# Altium schematic sheet can-transceiver.SchDoc
size A3; DocumentNumber: 4; SheetNumber: 4; SheetTotal: 45; SheetDescription: CAN Transceiver
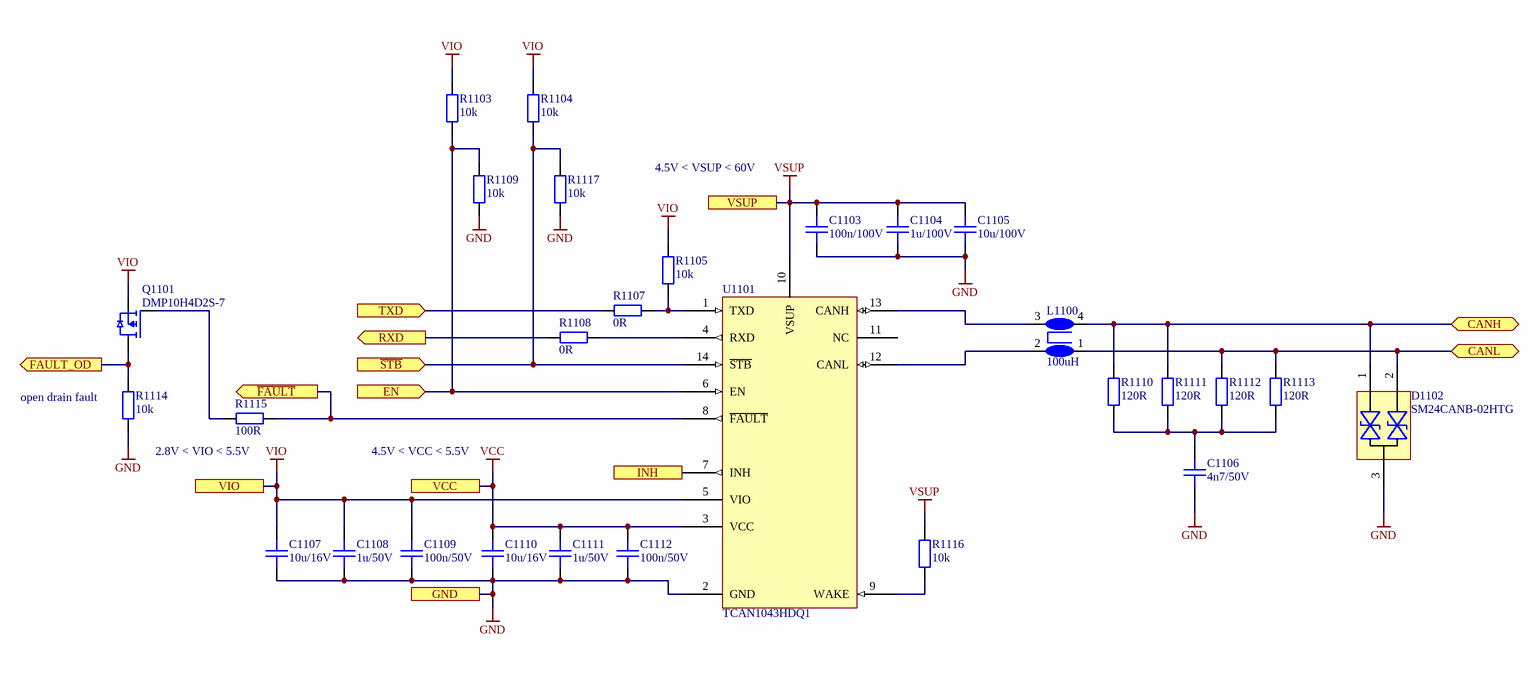
[diagram p0: can-transceiver.SchDoc]

## Parts
C1103  100n/100V  [CAPC1608X08N]
C1104  1u/100V  [CAPC3216X18N]
C1105  10u/100V  [CAPC5750X28N]
C1106  4n7/50V  [CAPC1005X06N]
C1107  10u/16V  [CAPC2012X14N]
C1108  1u/50V  [CAPC1608X08N]
C1109  100n/50V  [CAPC1005X06N]
C1110  10u/16V  [CAPC2012X14N]
C1111  1u/50V  [CAPC1608X08N]
C1112  100n/50V  [CAPC1005X06N]
D1102  SM24CANB-02HTG  [LF_SOT23-3]
L1100  100uH  [MURATA_DLW32SH]
Q1101  DMP10H4D2S-7  [SOT95P237X110-3N]
R1103  10k  [RESC1005X04N]
R1104  10k  [RESC1005X04N]
R1105  10k  [RESC1005X04N]
R1107  0R  [RESC1005X04N]
R1108  0R  [RESC1005X04N]
R1109  10k  [RESC1005X04N]
R1110  120R  [RESC3216X06N]
R1111  120R  [RESC3216X06N]
R1112  120R  [RESC3216X06N]
R1113  120R  [RESC3216X06N]
R1114  10k  [RESC1005X04N]
R1115  100R  [RESC1005X04N]
R1116  10k  [RESC1005X04N]
R1117  10k  [RESC1005X04N]
U1101  TCAN1043HDQ1  [TI_D0014A-C01_SOIC-14]

## Ports
CANH (bidir), CANL (bidir), EN (in), FAULT_OD (out), GND, INH, RXD (out), TXD (in), VCC, VIO, VSUP, ~{FAULT} (out), ~{STB} (in)

## Nets
GND: C1103.1 C1104.1 C1105.1 C1106.1 C1107.1 C1108.1 C1109.1 C1110.1 C1111.1 C1112.1 D1102.3 R1109.1 R1114.1 R1117.1 U1101.2(GND) ; port GND
VCC: C1110.2 C1111.2 C1112.2 U1101.3(VCC) ; port VCC
VIO: C1107.2 C1108.2 C1109.2 Q1101.S R1103.2 R1104.2 R1105.2 U1101.5(VIO) ; port VIO
VSUP: C1103.2 C1104.2 C1105.2 R1116.2 U1101.10(VSUP) ; port VSUP
~{FAULT}: R1115.2 U1101.8(~{FAULT}) ; port ~{FAULT}
~{STB}: R1104.1 R1117.2 U1101.14(~{STB}) ; port ~{STB}
CANH: D1102.1 L1100.4 R1110.2 R1111.2 ; port CANH
CANL: D1102.2 L1100.1 R1112.2 R1113.2 ; port CANL
EN: R1103.1 R1109.2 U1101.6(EN) ; port EN
FAULT_OD: Q1101.D R1114.2 ; port FAULT_OD
INH: U1101.7(INH) ; port INH
RXD: R1108.1 ; port RXD
TXD: R1107.1 ; port TXD
NetC1106_2: C1106.2 R1110.1 R1111.1 R1112.1 R1113.1
NetL1100_2: L1100.2 U1101.12(CANL)
NetL1100_3: L1100.3 U1101.13(CANH)
NetQ1101_G: Q1101.G R1115.1
NetR1105_1: R1105.1 R1107.2 U1101.1(TXD)
NetR1108_2: R1108.2 U1101.4(RXD)
NetR1116_1: R1116.1 U1101.9(WAKE)

Not connected (* = marked no-connect by the designer): U1101 11(NC)

## Notes on the sheet
- 4.5V < VSUP < 60V
- (near R1114) open drain fault
- 2.8V < VIO < 5.5V
- 4.5V < VCC < 5.5V
- Fraunhofer IISB
- Schottkystr. 10
- developed by:
- 91058 Erlangen
- Germany
- Author
- Project
- License
- Description
- File
- Version
- Release Date
- Sheet
- foxbms.org <https://foxbms.org>
- www.iisb.fraunhofer.de <https://www.iisb.fraunhofer.de/>
- foxBMS Team
- /

## Library data of the parts
C1103 = gen_C_ceramic_100n_100V_X7R_0603: MLCC; Capacitance: 100n; Rated Voltage: 100V; Dielectric: X7R; Case EIA: 0603; Case Metric: 1608; Automotive Qualified: True; PnP Package: 0603C; Part Number: gen_C_ceramic_100n_100V_X7R_0603; Supplier 1: Digikey; Supplier Part Number 1: 490-13420-1-ND; Supplier 2: Mouser; Supplier Part Number 2: 81-GCJ188R72A104KA1D
C1104 = gen_C_ceramic_1u_100V_X7R_1206: MLCC; Capacitance: 1u; Rated Voltage: 100V; Dielectric: X7R; Case EIA: 1206; Case Metric: 3216; AVT Set: x; Automotive Qualified: True; Part Number: gen_C_ceramic_1u_100V_X7R_1206; Supplier 1: Farnell; Supplier Part Number 1: 1833855
C1105 = gen_C_ceramic_10u_100V_X7S_2220: MLCC; Capacitance: 10u; Rated Voltage: 100V; Dielectric: X7S; Case EIA: 2220; Case Metric: 5750; Automotive Qualified: True; AEC-Q Grade: Grade 0; AEC-Q Norm: AEC-Q200; Part Number: gen_C_ceramic_10u_100V_X7S_2220; Supplier 1: Digikey; Supplier Part Number 1: 445-13152-1-ND; ECCN: EAR99
C1106 = gen_C_ceramic_4n7_50V_X7R_0402: MLCC; Capacitance: 4n7; Rated Voltage: 50V; Dielectric: X7R; Case EIA: 0402; Case Metric: 1005; Automotive Qualified: True; AEC-Q Grade: Grade 1; AEC-Q Norm: AEC-Q200; PnP Package: 0402C; Part Number: gen_C_ceramic_4n7_50V_X7R_0402; ECCN: EAR99; Supplier 1: Digikey; Supplier Part Number 1: 490-14739-1-ND
C1107 C1110 = gen_C_ceramic_10u_16V_X7R_0805: MLCC; Capacitance: 10u; Rated Voltage: 16V; Dielectric: X7S; Case EIA: 0805; Case Metric: 2012; Automotive Qualified: True; AEC-Q Grade: Grade 1; AEC-Q Norm: AEC-Q200; Part Number: gen_C_ceramic_10u_16V_X7R_0805; ECCN: EAR99; Supplier 1: Digikey; Supplier Part Number 1: 445-16110-1-ND
C1108 C1111 = gen_C_ceramic_1u_50V_X7R_0603: MLCC; Capacitance: 1u; Rated Voltage: 50V; Dielectric: X7R; Case EIA: 0603; Case Metric: 1608; Automotive Qualified: False; Tolerance: ± 10%; PnP Package: 0603C; Part Number: gen_C_ceramic_1u_50V_X7R_0603; Operating Temperature: -55°C - +125°C; Supplier 1: Farnell; Supplier Part Number 1: 2779055
C1109 C1112 = gen_C_ceramic_100n_50V_X7R_0402: MLCC; Capacitance: 100n; Rated Voltage: 50V; Dielectric: X7R; Case EIA: 0402; Case Metric: 1005; PnP Package: 0402C; PnP Value: 100nF/50V/X7R; PnP equipped: x; Automotive Qualified: True; AEC-Q Norm: AEC-Q200; Part Number: gen_C_ceramic_100n_50V_X7R_0402; Supplier 1: Farnell; Supplier Part Number 1: 2210822; ECCN: EAR99
D1102 = SM24CANB-02HTG: CAN ESD Protection Diode Array; Manufacturer: Littelfuse; Automotive Qualified: True; Part Number: SM24CANB-02HTG; Part Name: SM24CANB-02HTG; Operating Temperature: -40°C - +125°C; ComponentLink1Description: Datasheet; ComponentLink1URL: https://www.littelfuse.com/~/media/electronics/datasheets/tvs_diode_arrays/littelfuse_tvs_diode_array_sm24canb_datasheet.pdf.pdf; Supplier 1: Digikey; Supplier Part Number 1: F6707CT-ND
L1100 = DLW32SH101XF2L: Common Mode Choke; Manufacturer: Murata; Rated Current: 0.115A; Automotive Qualified: True; AEC-Q Norm: AEC-Q200; Part Number: DLW32SH101XF2L; Operating Temperature: –40°C - +125°C; ComponentLink1Description: Datasheet; ComponentLink1URL: https://4donline.ihs.com/images/VipMasterIC/IC/MURE/MURE-S-A0010901825/MURE-S-A0010900222-1.pdf?hkey=6D3A4C79FDBF58556ACFDE234799DDF0; Inductance: 100uH; Supplier 1: Farnell; Supplier Part Number 1: 3639227
Q1101 = DMP10H4D2S-7: MOSFET-Transistor, p-Kanal, 0.27 A, 100 V, 4.2 ohm; Manufacturer: Diodes; Maximum Drain-Source Voltage: 100V; Maximum Continous Drain Current (25°C): 0.27A; R_DS(on): 4.2; Total Gate Charge: 1.8nC; Automotive Qualified: True; Part Number: DMP10H4D2S-7; Part Name: PMOS; Operating Temperature: -55°C - +150°C; ComponentLink1Description: Datasheet; ComponentLink1URL: https://www.diodes.com/assets/Datasheets/DMP10H4D2S.pdf; Supplier 1: Farnell; Supplier Part Number 1: 3127354; Supplier 2: Digikey; Supplier Part Number 2: DMP10H4D2S-7DICT-ND; Supplier 3: Mouser; Supplier Part Number 3: 621-DMP10H4D2S-7
R1103-R1105 R1109 R1114 R1117 = gen_R_10k_0402: SMD Resistor 10k 0402; Tolerance: 1%; Power: 0.063W; Case EIA: 0402; Case Metric: 1005; Maximum Working Voltage: 50V; PnP Package: 0402R; PnP equipped: x; Automotive Qualified: True; AEC-Q Norm: AEC-Q200; Part Number: gen_R_10k_0402; Operating Temperature: -55°C - +155°C; Resistance: 10k; Series: E24, E96; PnP Value: 10k; Supplier 1: Farnell; Supplier Part Number 1: 2059239; ECCN: EAR99
R1107 R1108 = gen_R_0R_0402: SMD Resistor 0R 0402; Power: 0.063W; Case EIA: 0402; Case Metric: 1005; Maximum Working Voltage: 50V; PnP Package: 0402R; Automotive Qualified: True; AEC-Q Norm: AEC-Q200; PnP equipped: x; Part Number: gen_R_0R_0402; Operating Temperature: -55°C - +155°C; Resistance: 0R; Series: Jumper; PnP Value: 0R; Supplier 1: Farnell; Supplier Part Number 1: 1469661; Supplier 2: Farnell; Supplier Part Number 2: 2059190; ECCN: EAR99
R1110-R1113 = gen_R_120R_1206: SMD Resistor 120R 1206; Tolerance: 1%; Power: 0.3W; Case EIA: 1206; Case Metric: 3216; Maximum Working Voltage: 200V; PnP Package: 1206R; Automotive Qualified: True; AEC-Q Grade: Grade 0; AEC-Q Norm: AEC-Q200; Part Number: gen_R_120R_1206; Operating Temperature: -55°C - +155°C; Resistance: 120R; Series: E24; PnP Value: 120R; ECCN: EAR99; Supplier 1: Digikey; Supplier Part Number 1: A129799CT-ND
R1115 = gen_R_100R_0402: SMD Resistor 100R 0402; Tolerance: 1%; Power: 0.063W; Case EIA: 0402; Case Metric: 1005; Maximum Working Voltage: 50V; PnP Package: 0402R; PnP equipped: x; Automotive Qualified: True; AEC-Q Norm: AEC-Q200; Part Number: gen_R_100R_0402; Operating Temperature: -55°C - +155°C; Resistance: 100R; Series: E24, E96; PnP Value: 100R; Supplier 1: Farnell; Supplier Part Number 1: 2302528; ECCN: EAR99
R1116 = gen_R_10k_0402: SMD Resistor 10k 0402; Tolerance: 1%; Power: 0.063W; Case EIA: 0402; Case Metric: 1005; Maximum Working Voltage: 50V; PnP Package: 0402R; Automotive Qualified: True; PnP equipped: x; AEC-Q Norm: AEC-Q200; Part Number: gen_R_10k_0402; Operating Temperature: -55°C - +155°C; Resistance: 10k; Series: E24, E96; PnP Value: 10k; Supplier 1: Farnell; Supplier Part Number 1: 2059239; ECCN: EAR99
U1101 = TCAN1043HDQ1: Low-Power Fault Protected CAN Transceiver with CAN FD and Wake; Manufacturer: Texas Instruments; PnP Package: SOIC-14; Automotive Qualified: True; AEC-Q Norm: AEC-Q100; AEC-Q Grade: Grade 1; Part Number: TCAN1043HDQ1; Part Name: TCAN1043HDQ1; Operating Temperature: −55°C - +125°C; ComponentLink1Description: Datasheet; ComponentLink1URL: https://www.ti.com/lit/ds/symlink/tcan1043h-q1.pdf?HQS=dis-mous-null-mousermode-dsf-pf-null-wwe&DCM=yes&ref_url=https%3A%2F%2Fwww.mouser.de%2F&distId=26; Supplier 1: Mouser; Supplier Part Number 1: 595-TCAN1043HDQ1; Supplier 2: Digikey; Supplier Part Number 2: 296-47920-ND; ECCN: EAR99